# EAGLE schematic OBI_SlaveBoard_rev5 (EAGLE 7.2.0)
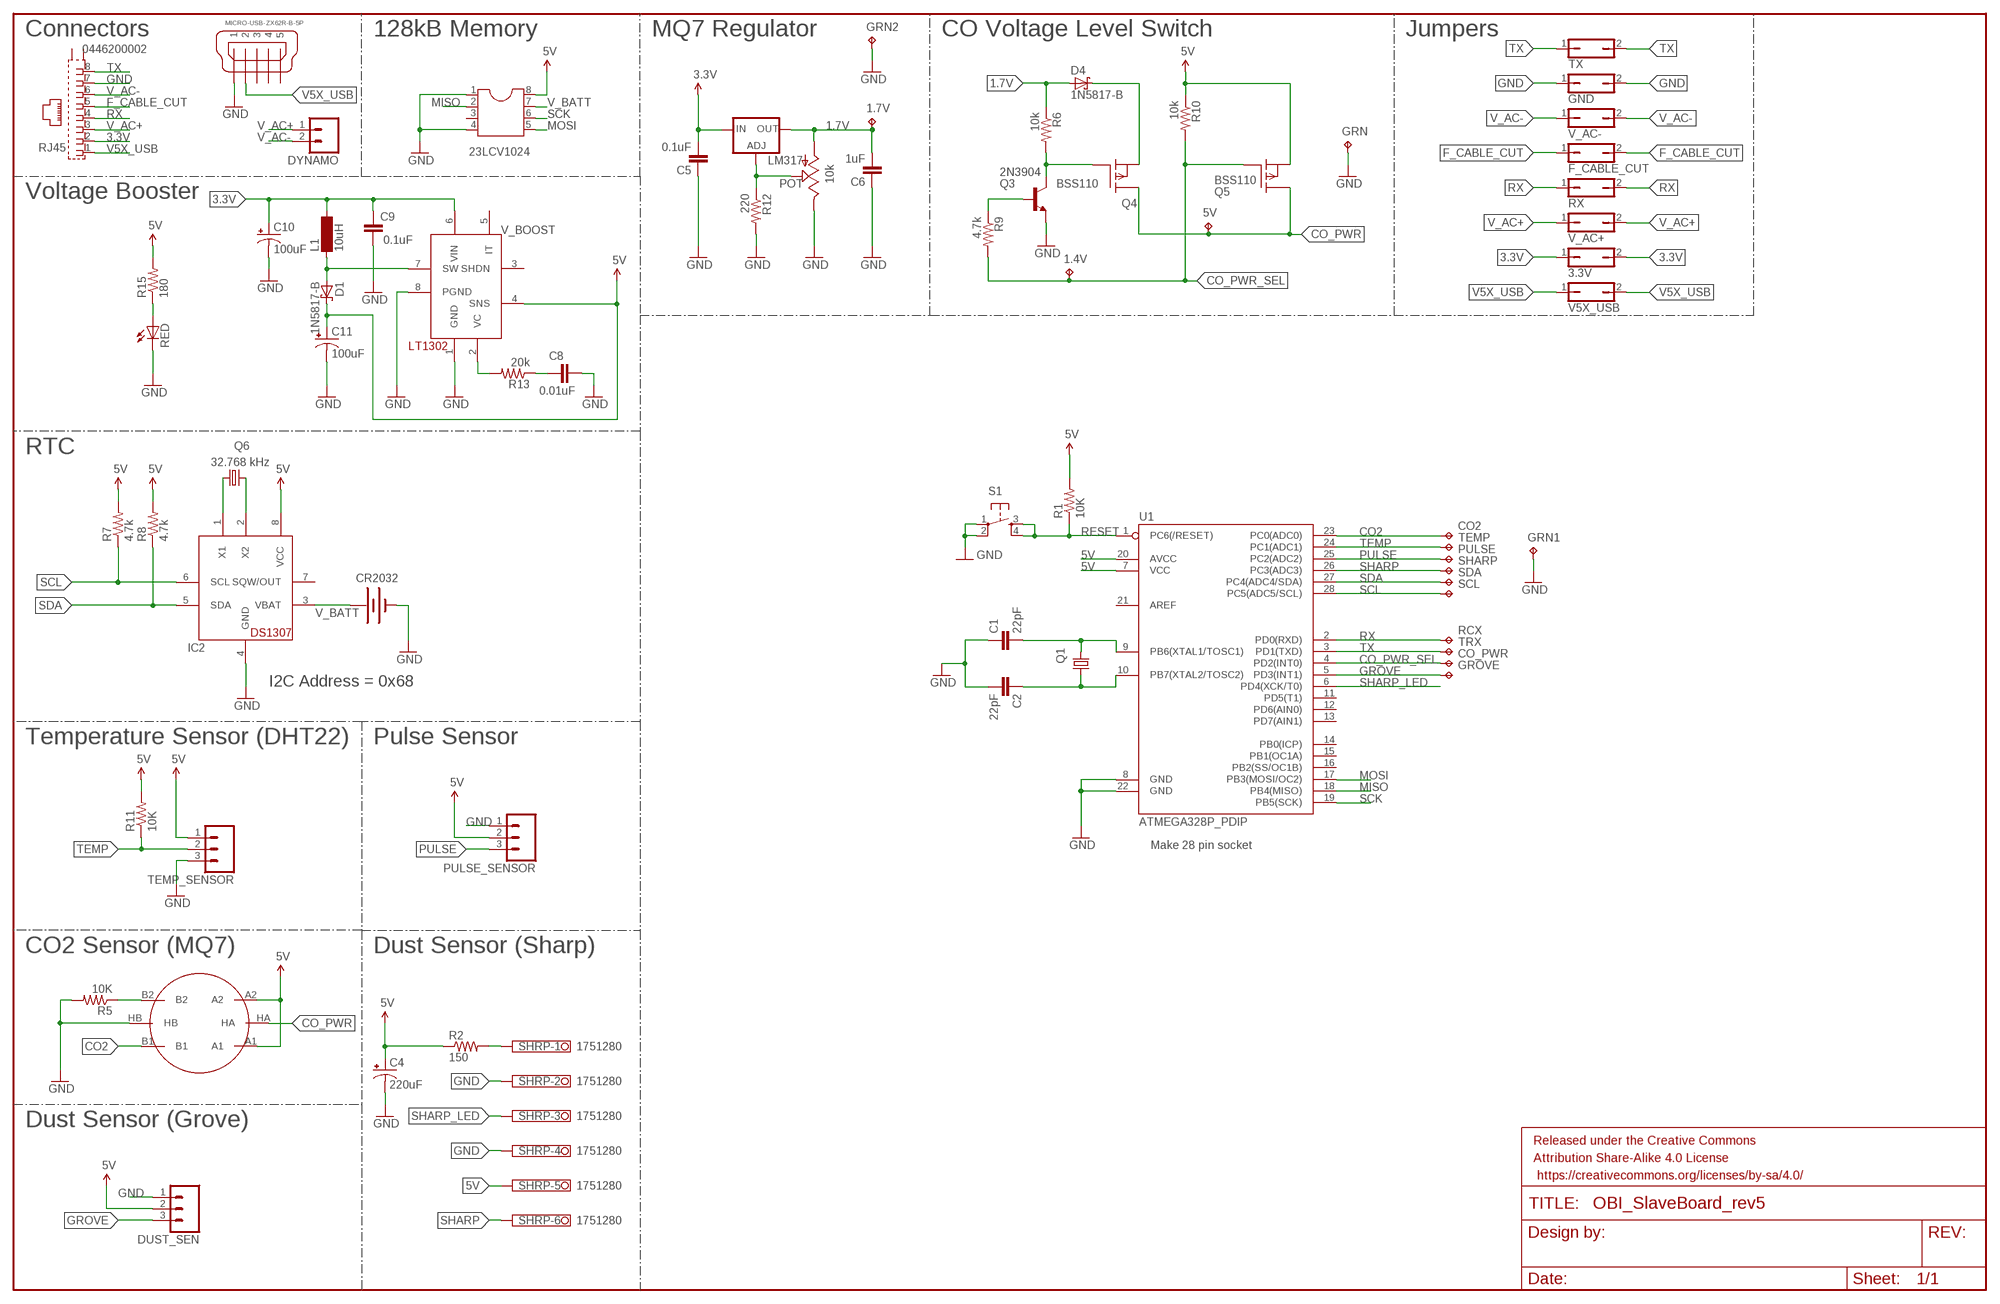
[diagram p0: schematic, sheet 1]

## Parts
1.4V  TPPAD1-13  [P1-13]
1.7V  TPPAD1-13  [P1-13]
3.3V  JP1Q  [JP1]
5V  TPPAD1-13  [P1-13]
23LCV1024  DIL8S  [SOCKET-08]
C1  22pF  CAPKIT  [CAP-PTH-SMALL-KIT]
C2  22pF  CAPKIT  [CAP-PTH-SMALL-KIT]
C4  220uF  CAP_POLPTH2  [CPOL-RADIAL-10UF-25V]
C5  0.1uF  CAPKIT  [CAP-PTH-SMALL-KIT]
C6  1uF  CAPKIT  [CAP-PTH-SMALL-KIT]
C8  0.01uF  CAPKIT  [CAP-PTH-SMALL-KIT]
C9  0.1uF  CAPKIT  [CAP-PTH-SMALL-KIT]
C10  100uF  CPOL-USTT2D5  [TT2D5]
C11  100uF  CPOL-USTT2D5  [TT2D5]
CO2  TPPAD1-13  [P1-13]
CO2_SENSOR  METHANE_SENSOR  [MQ-3]
CO_PWR  TPPAD1-13  [P1-13]
CR2032  BATTERY20PTH  [BATTCOM_20MM_PTH]
D1  1N5817-B  SCHOTTKY-DIODEDO41  [DO41-10]
D4  1N5817-B  SCHOTTKY-DIODEDO41  [DO41-10]
DUST_SEN  M03SCREW  [SCREWTERMINAL-3.5MM-3]
DYNAMO  M023.5MM  [SCREWTERMINAL-3.5MM-2]
F_CABLE_CUT  JP1Q  [JP1]
FRAME1  FRAME-LEDGER  [CREATIVE_COMMONS]
GND  JP1Q  [JP1]
GRN  TPPAD1-13  [P1-13]
GRN1  TPPAD1-13  [P1-13]
GRN2  TPPAD1-13  [P1-13]
GROVE  TPPAD1-13  [P1-13]
IC2  DS1307  [DIL08]
L1  10uH  BS11  [BS11]
LM317  LM317TS  [317TS]
MICROB  MICRO-USB-ZX62R-B-5P  [ZX62R-B-5P]
POT  10k  TRIM_US-CT6  [CT6]
PULSE  TPPAD1-13  [P1-13]
PULSE_SENSOR  M03SCREW  [SCREWTERMINAL-3.5MM-3]
Q1  CRYSTALHC49S  [HC49/S]
Q3  2N3904  TRANSISTOR_NPN2N3904  [TO-92]
Q4  BSS110  [TO92]
Q5  BSS110  [TO92]
Q6  32.768 kHz  CRYSTALTC26V  [TC26V]
R1  10K  RESISTORPTH-1/4W  [AXIAL-0.4]
R2  150  RESISTORPTH-1/4W  [AXIAL-0.4]
R5  10K  RESISTORPTH-1/4W  [AXIAL-0.4]
R6  10k  RESISTORPTH-1/4W  [AXIAL-0.4]
R7  4.7k  RESISTORPTH-1/4W  [AXIAL-0.4]
R8  4.7k  RESISTORPTH-1/4W  [AXIAL-0.4]
R9  4.7k  RESISTORPTH-1/4W  [AXIAL-0.4]
R10  10k  RESISTORPTH-1/4W  [AXIAL-0.4]
R11  10K  RESISTORPTH-1/4W  [AXIAL-0.4]
R12  220  RESISTORPTH-1/4W  [AXIAL-0.4]
R13  20k  RESISTORPTH-1/4W  [AXIAL-0.4]
R15  180  RESISTORPTH-1/4W  [AXIAL-0.4]
RCX  TPPAD1-13  [P1-13]
RED  LEDCHIPLED_1206  [CHIPLED_1206]
RJ45  0446200002  [0446200002]
RX  JP1Q  [JP1]
S1  TAC_SWITCHPTH  [TACTILE-PTH]
SCL  TPPAD1-13  [P1-13]
SDA  TPPAD1-13  [P1-13]
SHARP  TPPAD1-13  [P1-13]
SHRP  1751280  [1751280]
TEMP  TPPAD1-13  [P1-13]
TEMP_SENSOR  M03SCREW  [SCREWTERMINAL-3.5MM-3]
TRX  TPPAD1-13  [P1-13]
TX  JP1Q  [JP1]
U1  ATMEGA328P_PDIP  [DIL28-3]
V5X_USB  JP1Q  [JP1]
V_AC+  JP1Q  [JP1]
V_AC-  JP1Q  [JP1]
V_BOOST  LT1302  [DIL08]

## Nets
1.7V: 1.7V.TP C6.2 D4.A LM317.2(OUT) POT.A R6.P$1
3.3V: 3.3V.1 3.3V.2 C5.2 C9.1 C10.+ L1.2 LM317.3(IN) RJ45.2 V_BOOST.6(VIN)
5V [Power]: 23LCV1024.8 C4.1(+) C11.+ CO2_SENSOR.A1 CO2_SENSOR.A2 D1.C DUST_SEN.2 IC2.8(VCC) PULSE_SENSOR.2 Q5.1(S) R1.P$2 R2.P$1 R7.P$2 R8.P$2 R10.P$1 R11.P$2 R15.P$2 SHRP.5 TEMP_SENSOR.1 U1.7(VCC) U1.20(AVCC) V_BOOST.4(SNS)
CO2: CO2.TP CO2_SENSOR.B1 U1.23(PC0(ADC0))
CO_PWR: 5V.TP CO2_SENSOR.HA Q4.3(D) Q5.3(D)
CO_PWR_SEL: 1.4V.TP CO_PWR.TP Q5.2(G) R9.P$2 R10.P$2 U1.4(PD2(INT0))
F_CABLE_CUT: F_CABLE_CUT.1 F_CABLE_CUT.2 RJ45.5
GND: 23LCV1024.1 23LCV1024.4 C1.1 C2.2 C4.2(-) C5.1 C6.1 C8.1 C9.2 C10.- C11.- CO2_SENSOR.HB CR2032.2(-) DUST_SEN.1 GND.1 GND.2 GRN1.TP GRN2.TP GRN.TP IC2.4(GND) MICROB.1 POT.E PULSE_SENSOR.1 Q3.1(E) R5.P$2 R12.P$2 RED.C RJ45.7 S1.1 S1.2 SHRP.2 SHRP.4 TEMP_SENSOR.3 U1.8(GND) U1.22(GND) V_BOOST.1(GND) V_BOOST.8(PGND)
GROVE: DUST_SEN.3 GROVE.TP U1.5(PD3(INT1))
MISO: 23LCV1024.2 U1.18(PB4(MISO))
MOSI: 23LCV1024.5 U1.17(PB3(MOSI/OC2))
N$1: IC2.1(X1) Q6.1
N$2: Q3.3(C) Q4.2(G) R6.P$2
N$3: C1.2 Q1.2 U1.9(PB6(XTAL1/TOSC1))
N$4: Q3.2(B) R9.P$1
N$5: C2.1 Q1.1 U1.10(PB7(XTAL2/TOSC2))
N$6: IC2.2(X2) Q6.2
N$7: R15.P$1 RED.A
N$8: R2.P$2 SHRP.1
N$9: LM317.1(ADJ) POT.S R12.P$1
N$14: R13.P$2 V_BOOST.2(VC)
N$15: D4.C Q4.1(S)
N$17: CO2_SENSOR.B2 R5.P$1
N$18: C8.2 R13.P$1
N$22: D1.A L1.1 V_BOOST.7(SW)
PULSE: PULSE.TP PULSE_SENSOR.3 U1.25(PC2(ADC2))
RESET: R1.P$1 S1.3 S1.4 U1.1(PC6(/RESET))
RX: RCX.TP RJ45.4 RX.1 RX.2 U1.2(PD0(RXD))
SCK: 23LCV1024.6 U1.19(PB5(SCK))
SCL: IC2.6(SCL) R7.P$1 SCL.TP U1.28(PC5(ADC5/SCL))
SDA: IC2.5(SDA) R8.P$1 SDA.TP U1.27(PC4(ADC4/SDA))
SHARP: SHARP.TP SHRP.6 U1.26(PC3(ADC3))
SHARP_LED: SHRP.3 U1.6(PD4(XCK/T0))
TEMP: R11.P$1 TEMP.TP TEMP_SENSOR.2 U1.24(PC1(ADC1))
TX: RJ45.8 TRX.TP TX.1 TX.2 U1.3(PD1(TXD))
V5X_USB: MICROB.2 RJ45.1 V5X_USB.1 V5X_USB.2
V_AC+: DYNAMO.1 RJ45.3 V_AC+.1 V_AC+.2
V_AC-: DYNAMO.2 RJ45.6 V_AC-.1 V_AC-.2
V_BATT: 23LCV1024.7 CR2032.1(+) IC2.3(VBAT)
Unconnected: 23LCV1024.3 IC2.7(SQW/OUT) MICROB.3 MICROB.4 MICROB.5 RJ45.S@1(S1) RJ45.S@2(S2) U1.11(PD5(T1)) U1.12(PD6(AIN0)) U1.13(PD7(AIN1)) U1.14(PB0(ICP)) U1.15(PB1(OC1A)) U1.16(PB2(SS/OC1B)) U1.21(AREF) V_BOOST.3(SHDN) V_BOOST.5(IT)

## Notes on the sheet
- Connectors | 128kB Memory | MQ7 Regulator | CO Voltage Level Switch | Jumpers
- Voltage Booster
- RTC
- I2C Address = 0x68
- Temperature Sensor (DHT22) | Pulse Sensor
- Make 28 pin socket
- CO2 Sensor (MQ7) | Dust Sensor (Sharp)
- Dust Sensor (Grove)

## Library data of the parts
1.4V 1.7V 5V CO2 CO_PWR GRN GRN1 GRN2 GROVE PULSE RCX SCL SDA SHARP TEMP TRX = testpad:TP: Test pad
3.3V F_CABLE_CUT GND RX TX V5X_USB V_AC+ V_AC- = jumper:JP1Q: JUMPER
23LCV1024 = ic-package:DIL8: Dual In Line / Socket
C1 C2 C5 C6 C8 C9 = SparkFun-Passives:CAP: Capacitor Standard 0603 ceramic capacitor, and 0.1" leaded capacitor.
C4 = SparkFun-Capacitors:CAP_POL: Capacitor Polarized These are standard SMD and PTH capacitors. Normally 10uF, 47uF, and 100uF in electrolytic and tantalum varieties. Always verify the external diameter of the through hole cap, it varies with capacity, voltage, and manufacturer. The EIA devices should be standard.
C10 C11 = rcl:CPOL-US: POLARIZED CAPACITOR, American symbol
CO2_SENSOR = SparkFun-Sensors:METHANE_SENSOR: MQ-4 Methane Gas Sensor SEN-09404
CR2032 = SparkFun-Electromechanical:BATTERY: Battery Holders Various common sizes : AA, AAA, 18650 (PRT-12895), 20mm coin cell and 12mm coin cell. 20MM_4LEGS, BATT-10373
D1 D4 = adafruit:SCHOTTKY-DIODE: Schottky Diode
DUST_SEN PULSE_SENSOR TEMP_SENSOR = SparkFun-Connectors:M03: Header 3 Standard 3-pin 0.1" header. Use with straight break away headers (SKU : PRT-00116), right angle break away headers (PRT-00553), swiss pins (PRT-00743), machine pins (PRT-00117), and female headers (PRT-00115). Molex polarized connector foot print use with SKU : PRT-08232 with associated crimp pins and housings.
DYNAMO = SparkFun-Connectors:M02: Standard 2-pin 0.1" header. Use with - straight break away headers ( PRT-00116) - right angle break away headers (PRT-00553) - swiss pins (PRT-00743) - machine pins (PRT-00117) - female headers (PRT-00115) Molex polarized connector foot print use with: PRT-08233 with associated crimp pins and housings. 2.54_SCREWTERM for use with PRT-10571. 3.5mm Screw Terminal footprints for PRT-08084 5mm Screw Terminal footprints for use with PRT-08432; PROD_ID: CONN-08399
FRAME1 = SparkFun-Aesthetics:FRAME-LEDGER: Schematic Frame Standard 11x14 US Ledger frame
IC2 = adafruit:DS1307: DS1307 Real time clock (RTC) with battery backup ability. Talk to it via i2c
L1 = inductor-neosid:BS: INDUCTOR nominal inductance, magnetically screened; OC_FARNELL: unknown; OC_NEWARK: unknown
LM317 = v-reg:LM317TS: VOLTAGE REGULATOR
MICROB = con-hirose:MICRO-USB-: Hirose Micro USB Connector ZX62R-B-5P: Micro B, reverse (top mount) shell SMT Supplier: DigiKey H11574CT-ND Source: http://www.hirose.co.jp/cataloge_hp/e24200011.pdf
POT = pot:TRIM_US-: POTENTIOMETER
Q1 = crystal:CRYSTAL: CRYSTAL; OC_FARNELL: 1667008; OC_NEWARK: unknown
Q3 = SparkFun-DiscreteSemi:TRANSISTOR_NPN: Generic NPN BJT MMBT2222A - TRANS-08049 (SOT-23, 1A 40V) MPSA42 - TRANS-09116 (SOT-23, 500mA 300V) MMBT5088LT1G - TRANS-11160 (SOT-23, 50 mA 30V) BC547 - COM-08928 <http://www.sparkfun.com/products/8928> (TO-92 45V 100mA) (1.Collector 2.Base 3.Emitter) 2N3904 - COM-00521 <http://www.sparkfun.com/products/521> (TO-92 40V 200mA) (1.Emitter 2.Base 3.Collector) P2N2222A - COM-12852 <http://www.sparkfun.com/products/12852> (TO-92 40V 600mA) (1.Collector 2.Base 3.Emitter); PROD_ID: TRANS-08447
Q4 Q5 = transistor-fet:BSS110: P-Channel Enhancement MOSFET -50V; -0,17A; 6Ohm
Q6 = crystal:CRYSTAL: CRYSTAL; OC_FARNELL: unknown; OC_NEWARK: unknown
R1 R5 R7 R8 R15 = SparkFun-Passives:RESISTOR: Resistor Basic schematic elements and footprints for 0603, 1206, and PTH resistors.
R2 R6 R9-R13 = SparkFun-Resistors:RESISTOR: Resistor Basic schematic elements and footprints for 0603, 1206, and PTH resistors.
RED = adafruit:LED: LED OSRAM: - CHIPLED LG R971, LG N971, LY N971, LG Q971, LY Q971, LO R971, LY R971 LH N974, LH R974 LS Q976, LO Q976, LY Q976 LO Q996 - Hyper CHIPLED LW Q18S LB Q993, LB Q99A, LB R99A - SideLED LS A670, LO A670, LY A670, LG A670, LP A670 LB A673, LV A673, LT A673, LW A673 LH A674 LY A675 LS A676, LA A676, LO A676, LY A676, LW A676 LS A679, LY A679, LG A679 - Hyper Micro SIDELED® LS Y876, LA Y876, LO Y876, LY Y876 LT Y87S - SmartLED LW L88C, LW L88S LB L89C, LB L89S, LG L890 LS L89K, LO L89K, LY L89K LS L896, LA L896, LO L896, LY L896 - TOPLED LS T670, LO T670, LY T670, LG T670, LP T670 LSG T670, LSP T670, LSY T670, LOP T670, LYG T670 LG T671, LOG T671, LSG T671 LB T673, LV T673, LT T673, LW T673 LH T674 LS T676, LA T676, LO T676, LY T676, LB T676, LH T676, LSB T676, LW T676 LB T67C, LV T67C, LT T67C, LS T67K, LO T67K, LY T67K, LW E67C LS E67B, LA E67B, LO E67B, LY E67B, LB E67C, LV E67C, LT E67C LW T67C LS T679, LY T679, LG T679 LS T770, LO T770, LY T770, LG T770, LP T770 LB T773, LV T773, LT T773, LW T773 LH T774 LS E675, LA E675, LY E675, LS T675 LS T776, LA T776, LO T776, LY T776, LB T776 LHGB T686 LT T68C, LB T68C - Hyper Mini TOPLED® LB M676 - Mini TOPLED Santana® LG M470 LS M47K, LO M47K, LY M47K Source: http://www.osram.convergy.de/
RJ45 = con-molex:0446200002: RJ-45 INVERTED MODULAR JACK ASSEMBLY WITH RJ-11 KEEPOUT FEATURE Source: Data sheet <http://www.farnell.com/datasheets/73207.pdf> MOLEX 0446200002 BUCHSE, RJ45, GESCHIRMT Source: Farnell <http://de.farnell.com/molex/0446200002/buchse-rj45-geschirmt/dp/9251910?ost=9251910>; MF: MOLEX; MPN: 0446200002; OC_FARNELL: 9251910
S1 = SparkFun-Retired:TAC_SWITCH: Momentary Switch Button commonly used for reset or general input. Spark Fun Electronics SKU : COM-00097 SMT- SWCH-08247
SHRP = con-phoenix-350:1751280: MKDS 1/ 6-3,5 Printklemme Nennstrom: 10 A Bemessungsspannung: 160 V Raster: 3,5 mm Polzahl: 6 Montageart: Löten Anschlussart: Schraubanschluss Anschlussrichtung vom Leiter zur Platine: 0° Source: http://eshop.phoenixcontact.com .. 1751280.pdf; MPN: 1751280; OC_FARNELL: unknown; OC_NEWARK: 27R1765
U1 = SparkFun-DigitalIC:ATMEGA328P_PDIP: uC used in the Arduino 32kb flash, 1k EEPROM, 2k SRAM This is the through-hole version of this chip.
V_BOOST = adafruit:LT1302

## Net classes
1 Power: width 0.381 mm